# Altium schematic sheet power-supply.SchDoc
size A
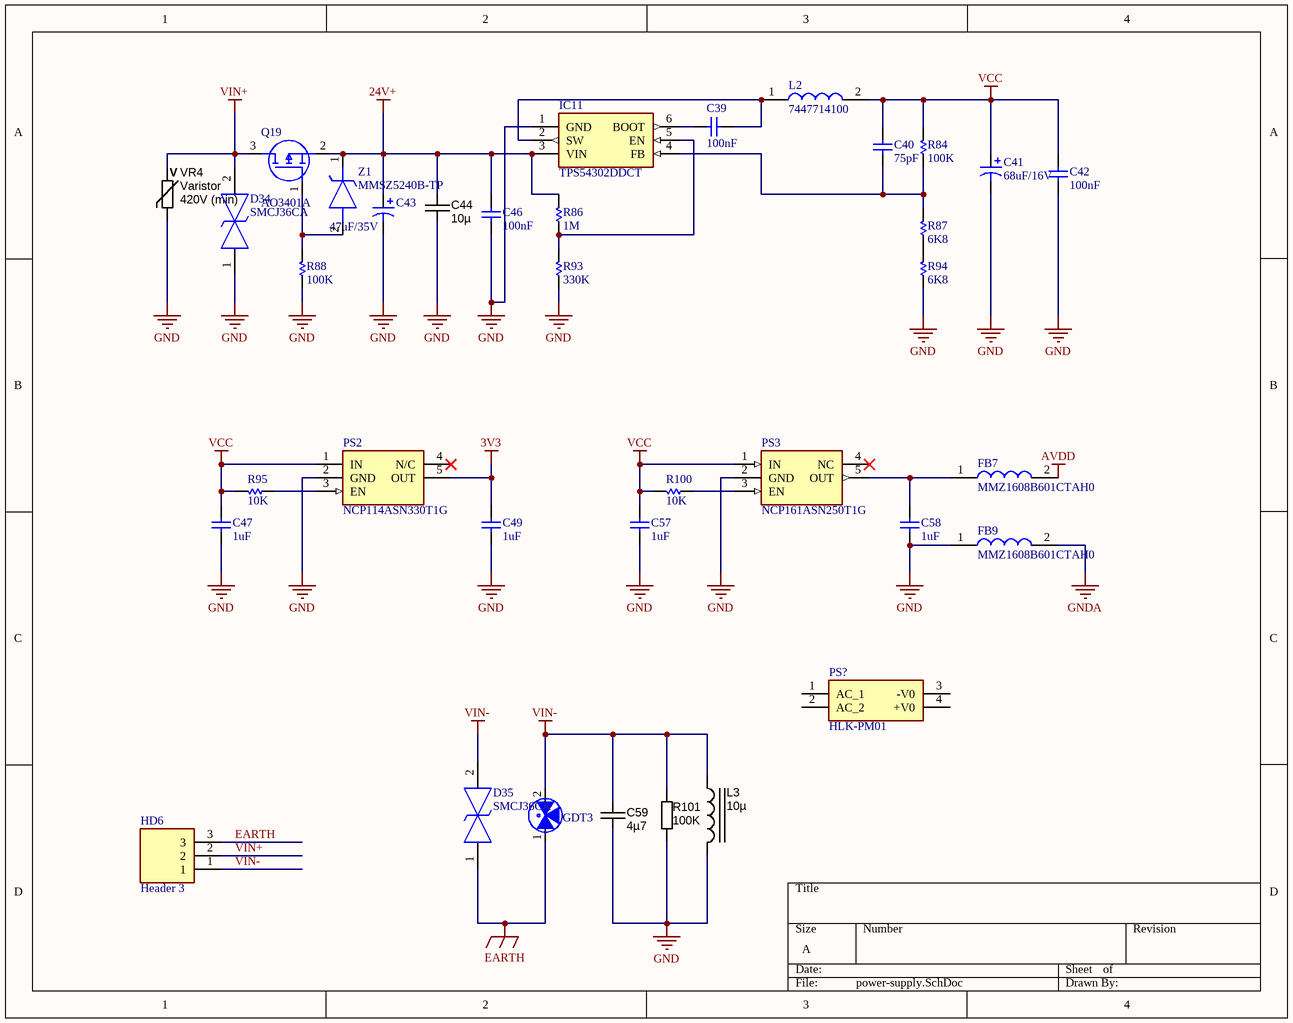
[diagram p0: power-supply.SchDoc]

## Parts
C39  100nF  [CAP-0603-Standard]
C40  75pF  [CAP-0603-Standard]
C41  68uF/16V  [C100uF_16V_ALUM_SMD]
C42  100nF  [CAP-0603-Standard]
C43  47uF/35V  [C100uF_16V_ALUM_SMD]
C44  10µ  [CAPC3225N]
C46  100nF  [CAP-0603-Standard]
C47  1uF  [CAP-0603-Standard]
C49  1uF  [CAP-0603-Standard]
C57  1uF  [CAP-0603-Standard]
C58  1uF  [CAP-0603-Standard]
C59  4µ7  [CAPC5750N]
D34  SMCJ36CA  [DIONM7959X262N]
D35  SMCJ36CA  [DIONM7959X262N]
FB7  MMZ1608B601CTAH0  [BEADC1608X95N]
FB9  MMZ1608B601CTAH0  [BEADC1608X95N]
GDT3  2RL150M-5  [2R-5-ST5]  (value not drawn)
HD6  Header 3  [SHDRRA3W80P0X381_1X3_1190X920X720P]
IC11  TPS54302DDCT  [SOT95P280X110-6N]
L2  7447714100  [WE-PD_1030/105054]
L3  10µ  [IND_WW_DR73]
PS2  NCP114ASN330T1G  [SOT95P275X110-5N]
PS3  NCP161ASN250T1G  [SOT95P280X145-5N]
PS?  HLK-PM01  [HLKPM01]
Q19  AO3401A  [SOT95P280X125-3N]
R84  100K  [RES-0603-STANDARD]
R86  1M  [RES-0603-STANDARD]
R87  6K8  [RES-0603-STANDARD]
R88  100K  [RES-0603-STANDARD]
R93  330K  [RES-0603-STANDARD]
R94  6K8  [RES-0603-STANDARD]
R95  10K  [RES-0603-STANDARD]
R100  10K  [RES-0603-STANDARD]
R101  100K  [RESC3216N]
VR4  Varistor  Ratings: 420V (min)  [Varistor_7.62and10mm]
Z1  MMSZ5240B-TP  [MMSZ5250BTP]

## Nets
3V3: C49.2 PS2.5(OUT)
24V+: C43.1 C44.1 C46.1 IC11.3(VIN) Q19.2(S) R86.2 Z1.1(K)
AVDD: FB7.2
EARTH: D35.1 GDT3.1 HD6.3
GND: C41.2 C42.1 C43.2 C44.2 C46.2 C47.1 C49.1 C57.1 C58.1 C59.2 D34.1 FB9.1 IC11.1(GND) L3.2 PS2.2(GND) PS3.2(GND) R88.1 R93.1 R94.1 R101.2 VR4.2
GNDA: FB9.2
VCC: C40.2 C41.1 C42.2 C47.2 C57.2 L2.2 PS2.1(IN) PS3.1(IN) R84.2 R95.2 R100.2
VIN+: D34.2 HD6.2 Q19.3(D) VR4.1
VIN-: C59.1 D35.2 GDT3.2 HD6.1 L3.1 R101.1
NetC39_1: C39.1 IC11.2(SW) L2.1
NetC39_2: C39.2 IC11.6(BOOT)
NetC40_1: C40.1 IC11.4(FB) R84.1 R87.2
NetC58_2: C58.2 FB7.1 PS3.5(OUT)
NetIC11_5: IC11.5(EN) R86.1 R93.2
NetPS2_3: PS2.3(EN) R95.1
NetPS3_3: PS3.3(EN) R100.1
NetQ19_1: Q19.1(G) R88.2 Z1.2(A)
NetR87_1: R87.1 R94.2

Not connected (* = marked no-connect by the designer): PS2 4(N/C)*; PS3 4(NC)*; PS? 1(AC_1) 2(AC_2) 3(-V0) 4(+V0)

## Notes on the sheet
- (in symbol Varistor_MOV) V

## Library data of the parts
C39 C42 C46 = CAP-0603-0.1uF: CAP-CER, SMD, 0603, 0.1UF; Manufacturer: AVX; Manufacturer Part Number: 06031C104JAT2A; Tolerance: ±5%; Voltage - Rated: 100V; Operating Temperature: -55°C ~ 125°C; Package / Case: 0603 (1608 Metric); Distributor: Mouser; Price: 0.66; Capacitance: 100nF
C40 = CAP-0603-0.1uF: CAP-CER, SMD, 0603, 0.1UF, 5%, 100V; Manufacturer: AVX; Manufacturer Part Number: 06031C104JAT2A; Tolerance: ±5%; Operating Temperature: -55°C ~ 125°C; Package / Case: 0603 (1608 Metric); Voltage - Rated: 100V; Distributor: Mouser; Price: 0.66; Capacitance: 75pF
C41 = Cap_Alum_1000uF 16V: Alumimum eletrolytic cappacistor 68uF 16V 10x10 SMD; Voltage: 16V; Package: 10x10MM; Value: 68uF/16V
C43 = Cap_Alum_1000uF 16V: Alumimum eletrolytic cappacistor 47uF/35V 10x10 SMD; Voltage: 16V; Package: 10x10MM; Value: 47uF/35V
C44 = CAPC_10u_1210_50V: Capacitor SMD Cer 10uF 20% 16V X5R 1210; Manufacturer 1: Taiyo Yuden; Manufacturer Part Number 1: UMK325BJ106MM-T; Ratings: 50V; X5R; Material: ceramic; Package / Case: 1210 (3225 Metric); Tolerance: ±20%; Size / Dimension: 0.126" L x 0.098" W (3.20mm x 2.50mm); Supplier 1: Digi-Key; Supplier Part Number 1: 587-2225-1-ND; Value: 10µ
C47 C49 C57 C58 = CAP-0603-0.1uF: CAP-CER, SMD, 0603, 1UF; Manufacturer: AVX; Manufacturer Part Number: 06031C104JAT2A; Tolerance: ±5%; Voltage - Rated: 100V; Operating Temperature: -55°C ~ 125°C; Package / Case: 0603 (1608 Metric); Distributor: Mouser; Price: 0.66; Capacitance: 1uF
C59 = CAPC_4u7_100V_2220: Capacitor SMD Cer 4.7uF 10% 100V X7R 2220; Manufacturer: TDK Corporation; Manufacturer Part Number: C5750X7R2A475K; Ratings: 100V; X7R; Material: ceramic; Package / Case: 2220 (5750 Metric); Tolerance: ±10%; Supplier 1: Digi-Key; Supplier Part Number 1: 445-4526-1-ND; Value: 4µ7
D34 D35 = SMCJ36CA: TVS Diode (Bi-directional); Manufacturer_Name: LITTELFUSE; Datasheet Link: https://www.littelfuse.com/products/tvs-diodes/surface-mount/~/media/electronics/datasheets/tvs_diodes/littelfuse_tvs_diode_smcj_datasheet.pdf.pdf; Height: 2.62mm; Manufacturer_Part_Number: SMCJ36CA; Arrow Part Number: SMCJ36CA; Arrow Price/Stock: https://www.arrow.com/en/products/smcj36ca/littelfuse; Mouser Part Number: 576-SMCJ36CA; Mouser Price/Stock: https://www.mouser.co.uk/ProductDetail/Littelfuse/SMCJ36CA?qs=zHiv0nsVGmqDVrcTX3XJRw%3D%3D
FB7 FB9 = MMZ1608B601CTAH0: Ferrite Bead; Manufacturer_Name: TDK; Datasheet Link: https://product.tdk.com/info/en/catalog/datasheets/beads_commercial_signal_mmz1608_en.pdf; Height: 0.95mm; Manufacturer_Part_Number: MMZ1608B601CTAH0; Arrow Part Number: MMZ1608B601CTAH0; Arrow Price/Stock: https://www.arrow.com/en/products/mmz1608b601ctah0/tdk; Mouser Part Number: 810-MMZ1608B601CTAH0; Mouser Price/Stock: https://www.mouser.co.uk/ProductDetail/TDK/MMZ1608B601CTAH0?qs=8Kz9Wu9QwqX2rZ3grlLL0Q%3D%3D
GDT3 = 2RL150M-5: GDT 150V 5KA 2 POLE SMD
HD6 = Header 3: Terminal Block Header, 3, 300 V, 12 A, 3.81 mm; Manufacturer_Name: Amphenol; Manufacturer_Part_Number: 20020110-D031A01LF; Datasheet Link: http://uk.rs-online.com/web/p/products/7075216; Height: 7.2mm; Arrow Part Number: 20020110-D031A01LF; Arrow Price/Stock: https://www.arrow.com/en/products/20020110-d031a01lf/amphenol
IC11 = TPS54302DDCT: Integrated Circuit; Manufacturer_Name: Texas Instruments; Datasheet Link: https://componentsearchengine.com/Datasheets/2/TPS54302DDCT.pdf; Height: 1.1mm; Manufacturer_Part_Number: TPS54302DDCT; Arrow Part Number: TPS54302DDCT; Arrow Price/Stock: https://www.arrow.com/en/products/tps54302ddct/texas-instruments; Mouser Part Number: 595-TPS54302DDCT; Mouser Price/Stock: https://www.mouser.co.uk/ProductDetail/Texas-Instruments/TPS54302DDCT?qs=zEmsApcVOkXGTx6CMk2KtQ%3D%3D
L2 = 7447714100: Inductor; Manufacturer_Name: Wurth Elektronik; Manufacturer_Part_Number: 7447714100; Arrow Part Number: 7447714100; Mouser Part Number: 710-7447714100; Mouser Price/Stock: https://www.mouser.com/Search/Refine.aspx?Keyword=710-7447714100
L3 = INDC_10u_DR73-100-R: Inductor Power 10µH 2.1A 7.6x7.6mm SMD; Manufacturer 1: Cooper Bussmann; Tolerance: ±20%; Material: ferrite shielded; Package / Case: 5.0x5.0x4.5mm; Ratings: 2.1 A; Supplier 1: Digi-Key; Supplier Part Number 1: 513-1129-1-ND; Manufacturer Part Number 1: DR73-100-R; ComponentLink1URL: http://www.cooperindustries.com/content/dam/public/bussmann/Electronics/Resources/Data%20Sheets/Bus_Elx_DS_4315_DR_Series.pdf; ComponentLink1Description: http://www.cooperindustries.com/content/dam/public/bussmann/Electronics/Resources/Data%20Sheets/Bus_Elx_DS_4315_DR_Series.pdf; Value: 10µ
PS2 = NCP114ASN330T1G: Power Supply; Manufacturer_Name: ON Semiconductor; Datasheet Link: https://componentsearchengine.com/Datasheets/2/NCP114ASN330T1G.pdf; Height: 1.1mm; Manufacturer_Part_Number: NCP114ASN330T1G; Arrow Part Number: NCP114ASN330T1G; Arrow Price/Stock: https://www.arrow.com/en/products/ncp114asn330t1g/on-semiconductor; Mouser Part Number: 863-NCP114ASN330T1G; Mouser Price/Stock: https://www.mouser.co.uk/ProductDetail/ON-Semiconductor/NCP114ASN330T1G?qs=OycAS1CGnljPBnaqdh%252BGIA%3D%3D
PS3 = NCP161ASN330T1G: Power Supply; Manufacturer_Name: ON Semiconductor; Datasheet Link: https://componentsearchengine.com/Datasheets/2/NCP161ASN330T1G.pdf; Height: 1.45mm; Manufacturer_Part_Number: NCP161ASN330T1G; Arrow Part Number: NCP161ASN330T1G; Arrow Price/Stock: https://www.arrow.com/en/products/ncp161asn330t1g/on-semiconductor; Mouser Part Number: 863-NCP161ASN330T1G; Mouser Price/Stock: https://www.mouser.co.uk/ProductDetail/ON-Semiconductor/NCP161ASN330T1G?qs=vLWxofP3U2ze5zA%252BHmAd3w%3D%3D
PS? = HLK-PM01: Power Supply; Manufacturer_Name: Hi-Link; Datasheet Link: https://datasheet.lcsc.com/szlcsc/1906201102_HI-LINK-HLK-PM03_C209904.pdf; Height: 15mm; Manufacturer_Part_Number: HLK-PM01; Arrow Part Number: HLK-PM01
Q19 = AO3401A: MOSFET (P-Channel); Manufacturer_Name: Alpha & Omega Semiconductors; Datasheet Link: http://aosmd.com/res/data_sheets/AO3401A.pdf; Height: 1.25mm; Manufacturer_Part_Number: AO3401A; Arrow Part Number: AO3401A; Arrow Price/Stock: https://www.arrow.com/en/products/ao3401a/alpha-and-omega-semiconductor
R84 R88 R93 = RES-0603: RES, SMD, 0603, 1%, 1/10W, THICK FILM; Manufacturer: Yageo; Manufacturer Part Number: AC0603FR-101KL; Power (Watts): 0.1W, 1/10W; Operating Temperature: -55°C ~ 155°C; Package / Case: 0603 (1608 Metric); Price: 0.1; Distributor: Mouser; Tolerance: 1%
  R84 R88: Resistance: 100K
  R93: Resistance: 330K
R86 R87 R94 R95 R100 = RES-0603: RES, SMD, 0603, 5%, 1/10W, THICK FILM; Manufacturer: Yageo; Manufacturer Part Number: AC0603FR-101KL; Tolerance: 1%; Power (Watts): 0.1W, 1/10W; Operating Temperature: -55°C ~ 155°C; Package / Case: 0603 (1608 Metric); Price: 0.1; Distributor: Mouser
  R86: Resistance: 1M
  R87 R94: Resistance: 6K8
  R95 R100: Resistance: 10K
R101 = RES_91R_1206_5%: Resistor SMD chip 91 Ohm 0.25W 5% 1206; Manufacturer 1: Yageo; Manufacturer Part Number 1: RC1206JR-0791RL; Ratings: 1/4 W; Package / Case: 1206 (3216 Metric); Tolerance: ±5%; Material: Thin Film; Supplier 1: Digi-Key; Supplier Part Number 1: 311-91ERCT-ND; ComponentLink1URL: http://www.yageo.com/documents/recent/PYu-RC1206_51_RoHS_L_4.pdf; ComponentLink1Description: http://www.yageo.com/documents/recent/PYu-RC1206_51_RoHS_L_4.pdf; Value: 100K
VR4 = Varistor_MOV: Varistor 420V min; Manufacturer 1: Bourns Inc.; Manufacturer Part Number 1: MOV-10D621K; Voltage: 620V; Supplier 1: Digi-Key; Supplier Part Number 1: MOV-10D621K-ND
Z1 = MMSZ5240B-TP: Zener Diode; Manufacturer_Name: Micro Commercial Components (MCC); Datasheet Link: https://componentsearchengine.com/Datasheets/1/MMSZ5240B-TP.pdf; Height: 1.35mm; Manufacturer_Part_Number: MMSZ5240B-TP; Arrow Part Number: MMSZ5240B-TP; Arrow Price/Stock: https://www.arrow.com/en/products/mmsz5240b-tp/micro-commercial-components; Mouser Part Number: 833-MMSZ5240B-TP; Mouser Price/Stock: https://www.mouser.co.uk/ProductDetail/Micro-Commercial-Components-MCC/MMSZ5240B-TP?qs=ZNK0BnemlqGllNl%2FFvx2%252BQ%3D%3D